# EAGLE design ziffy_board (EAGLE 6.4)
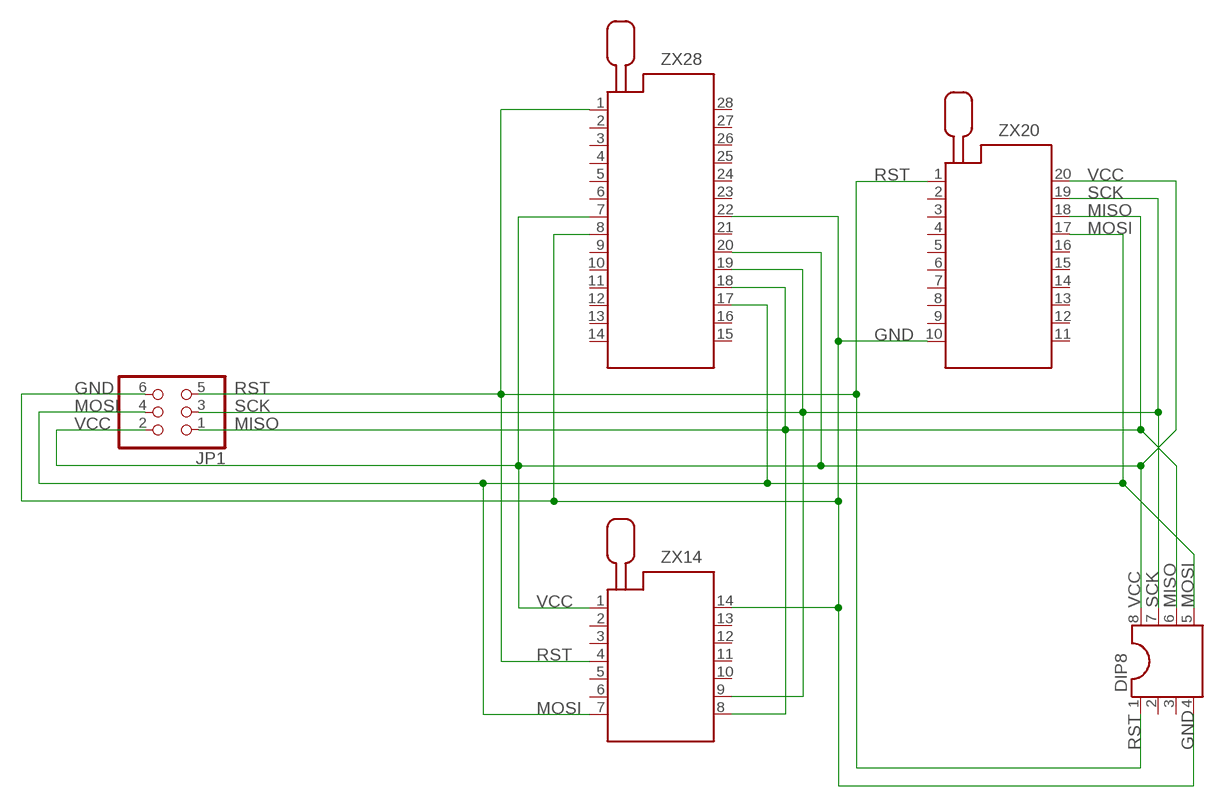
[diagram p0: schematic, sheet 1]

## Parts
DIP8  DIL8S  [SOCKET-08]
JP1  PINHD-2X3  [2X03]
ZX14  214-3339-00-0602J  [214-3339-00-0602J]
ZX20  220-3342-00-0602J  [220-3342-00-0602J]
ZX28  228-4817-00-0602J  [228-4817-00-0602J]

## Nets
GND: DIP8.4 JP1.6 ZX14.14 ZX20.10 ZX28.8 ZX28.22
MISO: DIP8.6 JP1.1 ZX14.8 ZX20.18 ZX28.18
MOSI: DIP8.5 JP1.4 ZX14.7 ZX20.17 ZX28.17
RST: DIP8.1 JP1.5 ZX14.4 ZX20.1 ZX28.1
SCK: DIP8.7 JP1.3 ZX14.9 ZX20.19 ZX28.19
VCC: DIP8.8 JP1.2 ZX14.1 ZX20.20 ZX28.7 ZX28.20
Unconnected: DIP8.2 DIP8.3 ZX14.2 ZX14.3 ZX14.5 ZX14.6 ZX14.10 ZX14.11 ZX14.12 ZX14.13 ZX20.2 ZX20.3 ZX20.4 ZX20.5 ZX20.6 ZX20.7 ZX20.8 ZX20.9 ZX20.11 ZX20.12 ZX20.13 ZX20.14 ZX20.15 ZX20.16 ZX28.2 ZX28.3 ZX28.4 ZX28.5 ZX28.6 ZX28.9 ZX28.10 ZX28.11 ZX28.12 ZX28.13 ZX28.14 ZX28.15 ZX28.16 ZX28.21 ZX28.23 ZX28.24 ZX28.25 ZX28.26 ZX28.27 ZX28.28

## Library data of the parts
DIP8 = ic-package:DIL8: Dual In Line / Socket
JP1 = pinhead:PINHD-2X3: PIN HEADER
ZX14 = con-3m:214-3339-00-0602J: Zero Insertion Force Socked Source: http://www.3M.com/ehpd; MF: 3M; MPN: 214-3339-00-0602J; OC_FARNELL: 1247151; OC_NEWARK: 85K7793
ZX20 = con-3m:220-3342-00-0602J: Zero Insertion Force Socked Source: http://www.3M.com/ehpd; MF: 3M; MPN: 220-3342-00-0602J; OC_FARNELL: 9897445; OC_NEWARK: 85K7807
ZX28 = con-3m:228-?00-0602J: Zero Insertion Force Socked Source: http://www.3M.com/ehpd; MF: 3M; MPN: 228-4817-00-0602J; OC_FARNELL: 1252775; OC_NEWARK: 85K7834

## Board
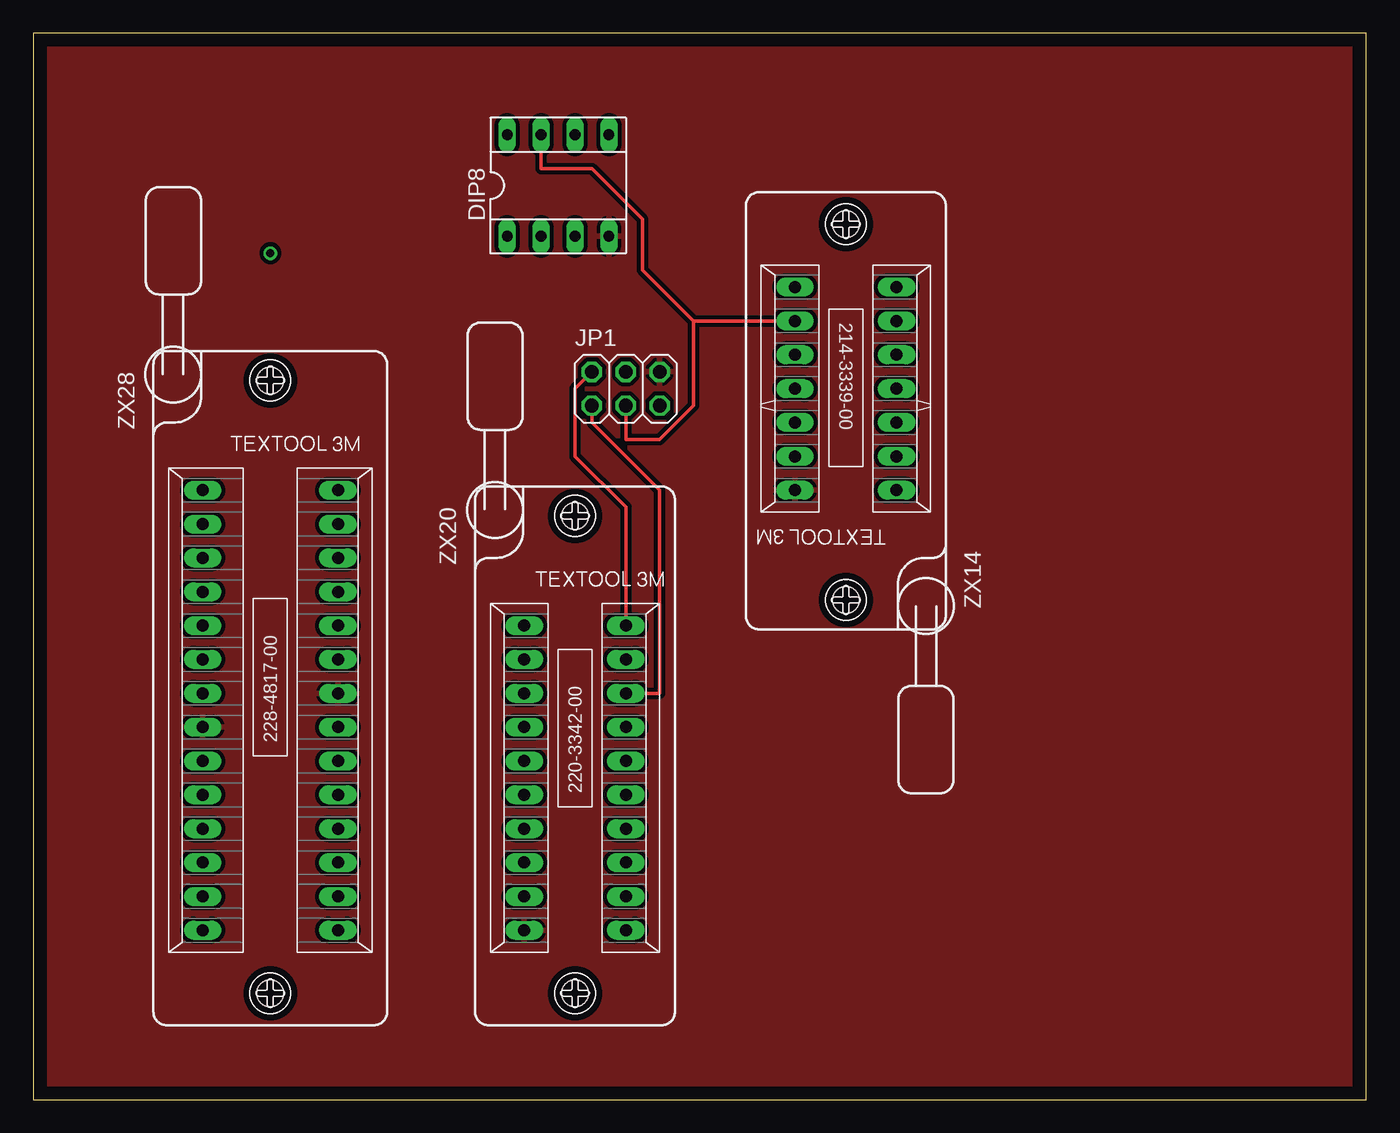
[diagram p1: board, top side]
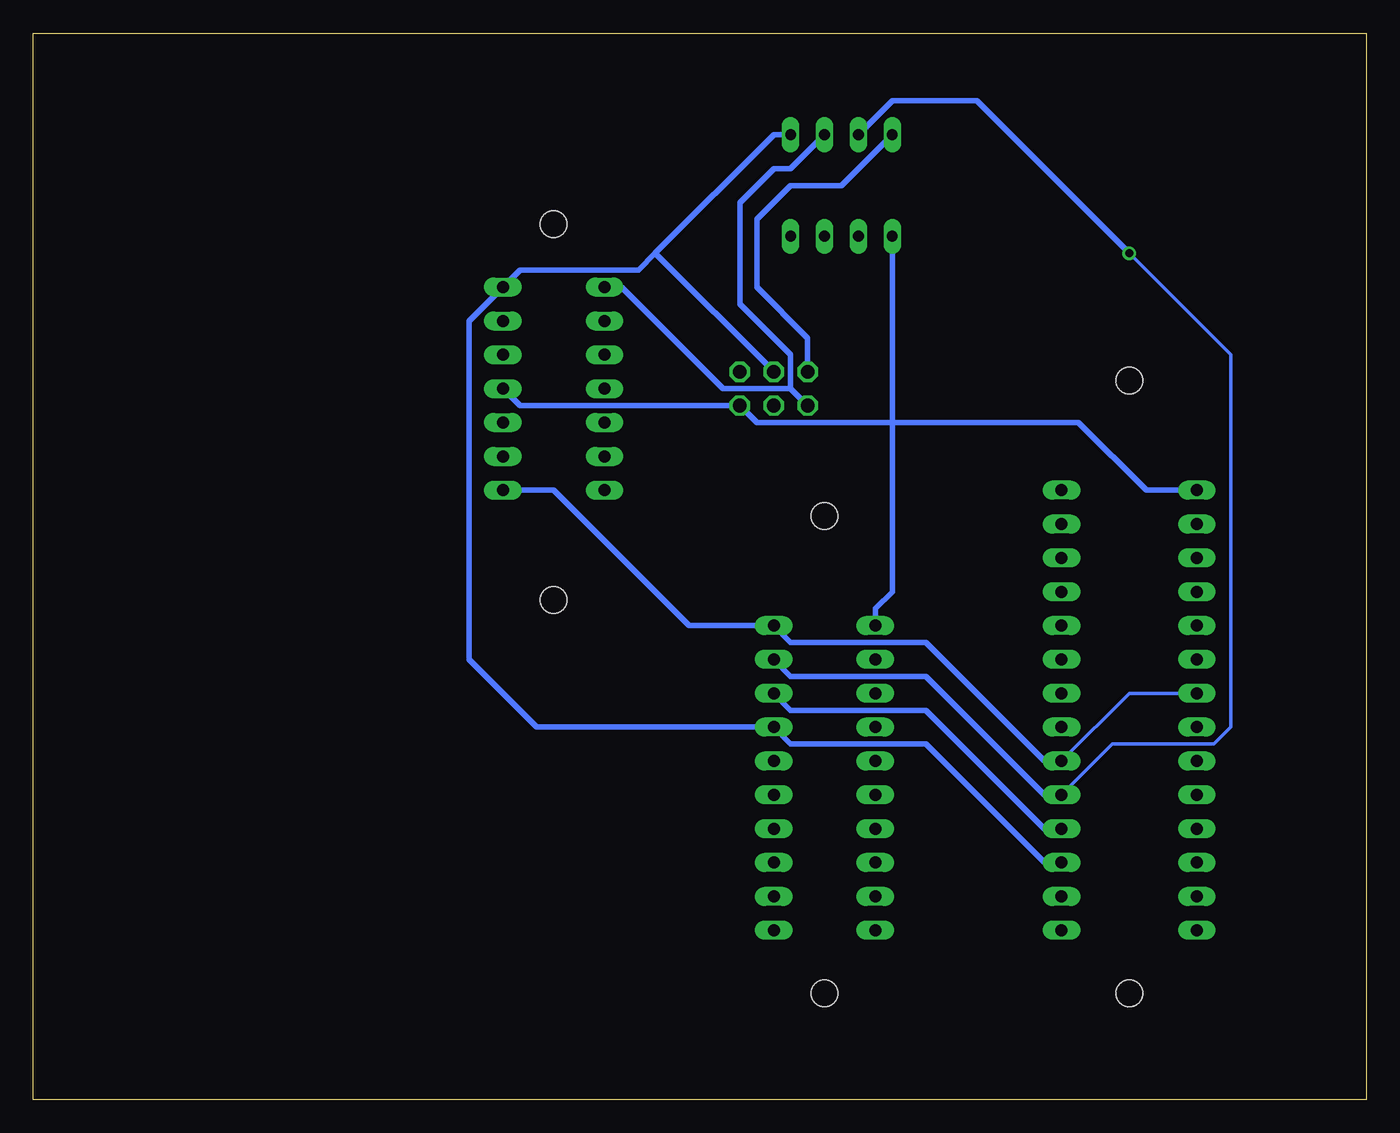
[diagram p2: board, bottom side, seen from below]

Size 100 x 80 mm. Coordinates in mm from the lower left corner, seen from the top.
Outline: 0,0 100,0 100,80 0,80 0,0
Copper layers (1*16): Top 0.035mm / dielectric 1.5mm / Bottom 0.035mm
Design rules "default": minimum track width 10mil, minimum drill 24mil, track to track 8mil, track to pad 8mil, pad to pad 8mil, via to via 8mil, smd to smd 8mil, copper to edge 40mil, drill to drill 8mil, minimum pad ring 10mil, minimum via ring 8mil, stop-mask expansion 4mil, vias tented up to drill 0mil, thermal gap 10mil

### Footprints (pad centres in the part's own frame; a part is rotated, then mirrored left to right if it is on the bottom)
SOCKET-08 = drill 0.813 long: 1 -3.81,-3.81; 2 -1.27,-3.81; 3 1.27,-3.81; 4 3.81,-3.81; 5 3.81,3.81; 6 1.27,3.81; 7 -1.27,3.81; 8 -3.81,3.81
2X03 = drill 1.016 octagon: 1 -2.54,-1.27; 2 -2.54,1.27; 3 0,-1.27; 4 0,1.27; 5 2.54,-1.27; 6 2.54,1.27
214-3339-00-0602J = drill 0.9 long: 1 -7.62,-3.81; 2 -5.08,-3.81; 3 -2.54,-3.81; 4 0,-3.81; 5 2.54,-3.81; 6 5.08,-3.81; 7 7.62,-3.81; 8 7.62,3.81; 9 5.08,3.81; 10 2.54,3.81; 11 0,3.81; 12 -2.54,3.81; 13 -5.08,3.81; 14 -7.62,3.81 | hole 2: 12.35,0; -15.85,0
220-3342-00-0602J = drill 0.9 long: 1 -11.43,-3.81; 2 -8.89,-3.81; 3 -6.35,-3.81; 4 -3.81,-3.81; 5 -1.27,-3.81; 6 1.27,-3.81; 7 3.81,-3.81; 8 6.35,-3.81; 9 8.89,-3.81; 10 11.43,-3.81; 11 11.43,3.81; 12 8.89,3.81; 13 6.35,3.81; 14 3.81,3.81; 15 1.27,3.81; 16 -1.27,3.81; 17 -3.81,3.81; 18 -6.35,3.81; 19 -8.89,3.81; 20 -11.43,3.81 | hole 2: 16.16,0; -19.66,0
228-4817-00-0602J = drill 0.9 long: 1 -16.51,-5.08; 2 -13.97,-5.08; 3 -11.43,-5.08; 4 -8.89,-5.08; 5 -6.35,-5.08; 6 -3.81,-5.08; 7 -1.27,-5.08; 8 1.27,-5.08; 9 3.81,-5.08; 10 6.35,-5.08; 11 8.89,-5.08; 12 11.43,-5.08; 13 13.97,-5.08; 14 16.51,-5.08; 15 16.51,5.08; 16 13.97,5.08; 17 11.43,5.08; 18 8.89,5.08; 19 6.35,5.08; 20 3.81,5.08; 21 1.27,5.08; 22 -1.27,5.08; 23 -3.81,5.08; 24 -6.35,5.08; 25 -8.89,5.08; 26 -11.43,5.08; 27 -13.97,5.08; 28 -16.51,5.08 | hole 2: 21.24,0; -24.74,0

### Placement (x,y rotation side)
DIP8  39.37,68.58 0 top
JP1  44.45,53.34 0 top
ZX14  60.96,53.34 90 top
ZX20  40.64,24.13 270 top
ZX28  17.78,29.21 270 top

### Tracks (layer width: path | path; a pad name or v marks a point on that pad's centre or on a via)
GND
  pour Top (isolate 0.305): 0,80.01 100.33,80.01 100.33,0 0,0
MISO
  Top 0.254: ZX20.18 46.99,30.48 46.99,45.72 41.91,50.8 JP1.1
  Bottom 0.406: ZX28.18 24.13,20.32 33.02,29.21 43.18,29.21 ZX20.18 | JP1.1 43.18,53.34 | 43.18,53.34 48.26,53.34 55.88,60.96 ZX14.8 | 43.18,53.34 43.18,55.88 46.99,59.69 46.99,67.31 44.45,69.85 43.18,69.85 DIP8.6
MOSI
  Bottom 0.406: ZX28.17 24.13,17.78 33.02,26.67 43.18,26.67 ZX20.17 62.23,27.94 67.31,33.02 67.31,58.42 ZX14.7 63.5,62.23 54.61,62.23 53.34,63.5 | 53.34,63.5 JP1.4 | DIP8.5 44.45,72.39 53.34,63.5
RST
  Bottom 0.406: DIP8.1 35.56,50.8 | 35.56,50.8 45.72,50.8 JP1.5 63.5,52.07 ZX14.4 | ZX20.1 36.83,36.83 35.56,38.1 35.56,50.8 | ZX28.1 16.51,45.72 21.59,50.8 35.56,50.8
SCK  (via drill 0.61)
  Top 0.254: 49.53,58.42 ZX14.9 | 49.53,58.42 49.53,52.07 46.99,49.53 44.45,49.53 JP1.3 | 49.53,58.42 45.72,62.23 45.72,66.04 41.91,69.85 38.1,69.85 DIP8.7
  Bottom 0.254: v17.78,63.5 10.16,55.88 10.16,27.94 11.43,26.67 19.05,26.67 ZX28.19
  Bottom 0.406: ZX28.19 24.13,22.86 33.02,31.75 43.18,31.75 ZX20.19 | DIP8.7 35.56,74.93 29.21,74.93 v17.78,63.5
VCC
  Top 0.254: JP1.2 40.64,53.34 40.64,48.26 44.45,44.45 ZX20.20
  Bottom 0.254: ZX28.20 17.78,30.48 ZX28.7
  Bottom 0.406: ZX28.20 24.13,25.4 33.02,34.29 43.18,34.29 ZX20.20 50.8,35.56 60.96,45.72 ZX14.1 | JP1.2 41.91,57.15 45.72,60.96 45.72,66.04 43.18,68.58 39.37,68.58 DIP8.8